# Altium schematic sheet TOPSHEET.SchDoc
size A4; Author: Rachid AKKOUCHE; CompanyName: RASoftware; DrawnBy: Rachid AKKOUCHE; Engineer: Rachid AKKOUCHE; Organization: RASoftware; Address1: 2, rue Geroges MELIES; Address2: 78390 BOIS D'ARCY; Address3: FRANCE; DocumentNumber: BRA20210209_1; SheetNumber: 1; SheetTotal: 4; Dessinepar: Rachid AKKOUCHE; Property: RASoftware; ProjectName: Projet BRA
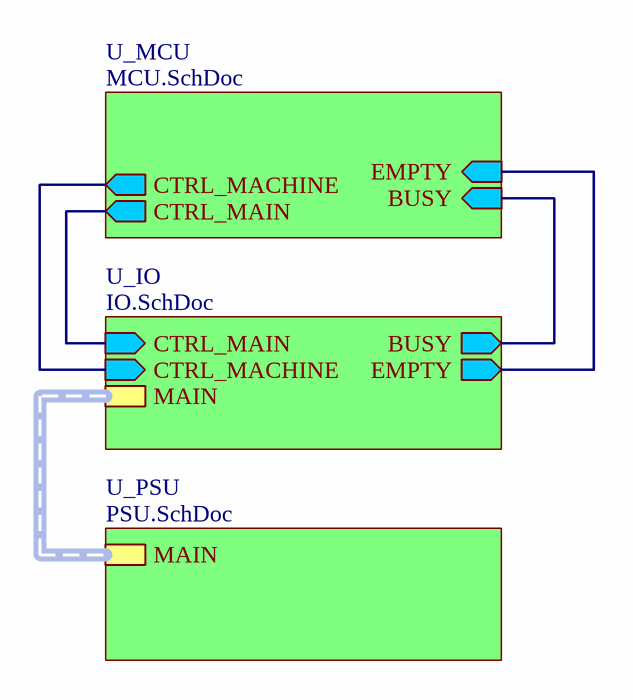
[diagram p0: TOPSHEET.SchDoc]

## Sub-sheets
U_IO = IO.SchDoc: BUSY (out), EMPTY (out), CTRL_MAIN (in), CTRL_MACHINE (in), MAIN (harness MAIN)
U_MCU = MCU.SchDoc: BUSY (in), EMPTY (in), CTRL_MAIN (out), CTRL_MACHINE (out)
U_PSU = PSU.SchDoc: MAIN (harness MAIN)

## Nets
(unnamed): sheet U_IO/BUSY, sheet U_MCU/BUSY
(unnamed): sheet U_IO/EMPTY, sheet U_MCU/EMPTY
(unnamed): sheet U_IO/CTRL_MAIN, sheet U_MCU/CTRL_MAIN
(unnamed): sheet U_IO/CTRL_MACHINE, sheet U_MCU/CTRL_MACHINE

## Buses and harness runs
harness sheet U_IO/MAIN = sheet U_PSU/MAIN

## Notes on the sheet
- Project:
- Il ne peut être divulgué sans l'accord écrit de l'un de ses représentants dûment mandaté
- Ce document est la propriété de
- Title:
- Number:
- Date:
- Time:
- Size:
- A4
- Revision:
- Sheet
- of
- 2, rue Georges MELIES
- Draw by:
- 78390 BOIS D'ARCY